# EAGLE design schematic (EAGLE 9.5.0)
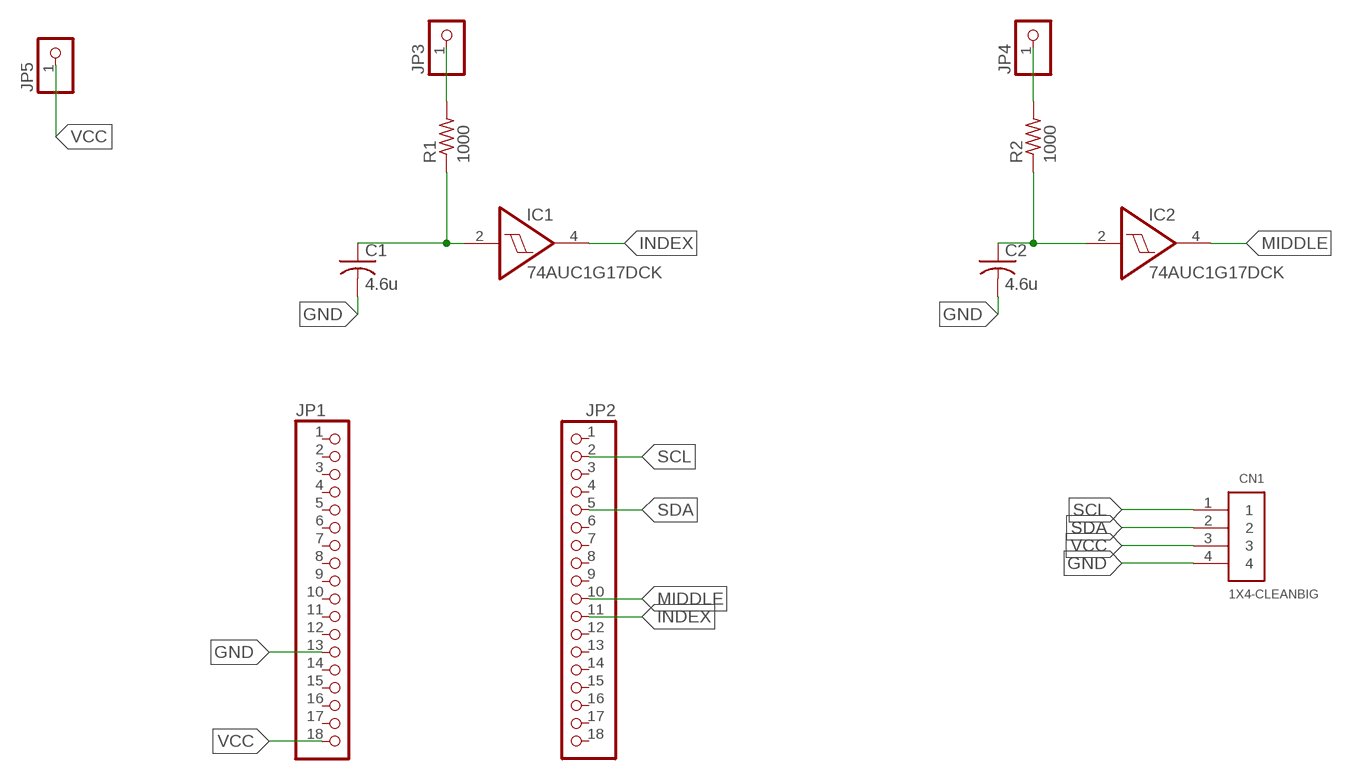
[diagram p0: schematic, sheet 1]

## Parts
C1  4.6u  C-USC0805  [C0805]
C2  4.6u  C-USC0805  [C0805]
CN1  1X4-CLEANBIG  [1X04-CLEANBIG]
IC1  74AUC1G17DCK  [SC70-5]
IC2  74AUC1G17DCK  [SC70-5]
JP1  PINHD-1X18-BIG  [1X18-BIG]
JP2  PINHD-1X18-BIG  [1X18-BIG]
JP3  PINHD-1X1CB  [1X01-CLEANBIG]
JP4  PINHD-1X1CB  [1X01-CLEANBIG]
JP5  PINHD-1X1CB  [1X01-CLEANBIG]
R1  1000  R-US_M0805  [M0805]
R2  1000  R-US_M0805  [M0805]

## Nets
GND: C1.2 C2.2 CN1.4 JP1.13
INDEX: IC1.4(O) JP2.11
MIDDLE: IC2.4(O) JP2.10
N$1: C1.1 IC1.2(I) R1.1
N$2: C2.1 IC2.2(I) R2.1
N$5: JP3.1 R1.2
N$6: JP4.1 R2.2
SCL: CN1.1 JP2.2
SDA: CN1.2 JP2.5
VCC: CN1.3 JP1.18 JP5.1
Unconnected: JP1.1 JP1.2 JP1.3 JP1.4 JP1.5 JP1.6 JP1.7 JP1.8 JP1.9 JP1.10 JP1.11 JP1.12 JP1.14 JP1.15 JP1.16 JP1.17 JP2.1 JP2.3 JP2.4 JP2.6 JP2.7 JP2.8 JP2.9 JP2.12 JP2.13 JP2.14 JP2.15 JP2.16 JP2.17 JP2.18

## Power pins joined to a net without a drawn wire
GND: IC1.3(GND) IC2.3(GND)
VCC: IC1.5(VCC) IC2.5(VCC)

## Library data of the parts
C1 C2 = adafruit:C-US: CAPACITOR, American symbol
CN1 = adafruit:1X4: 4-pin connector
IC1 IC2 = 74xx-little-de:74*1G17: Single Schmitt-Trigger Buffer
JP1 JP2 = adafruit:PINHD-1X18: PIN HEADER
JP3-JP5 = adafruit:PINHD-1X1: Pin header 1x1 for 0.1" spacing With round pins
R1 R2 = adafruit:R-US_: RESISTOR, American symbol

## Board
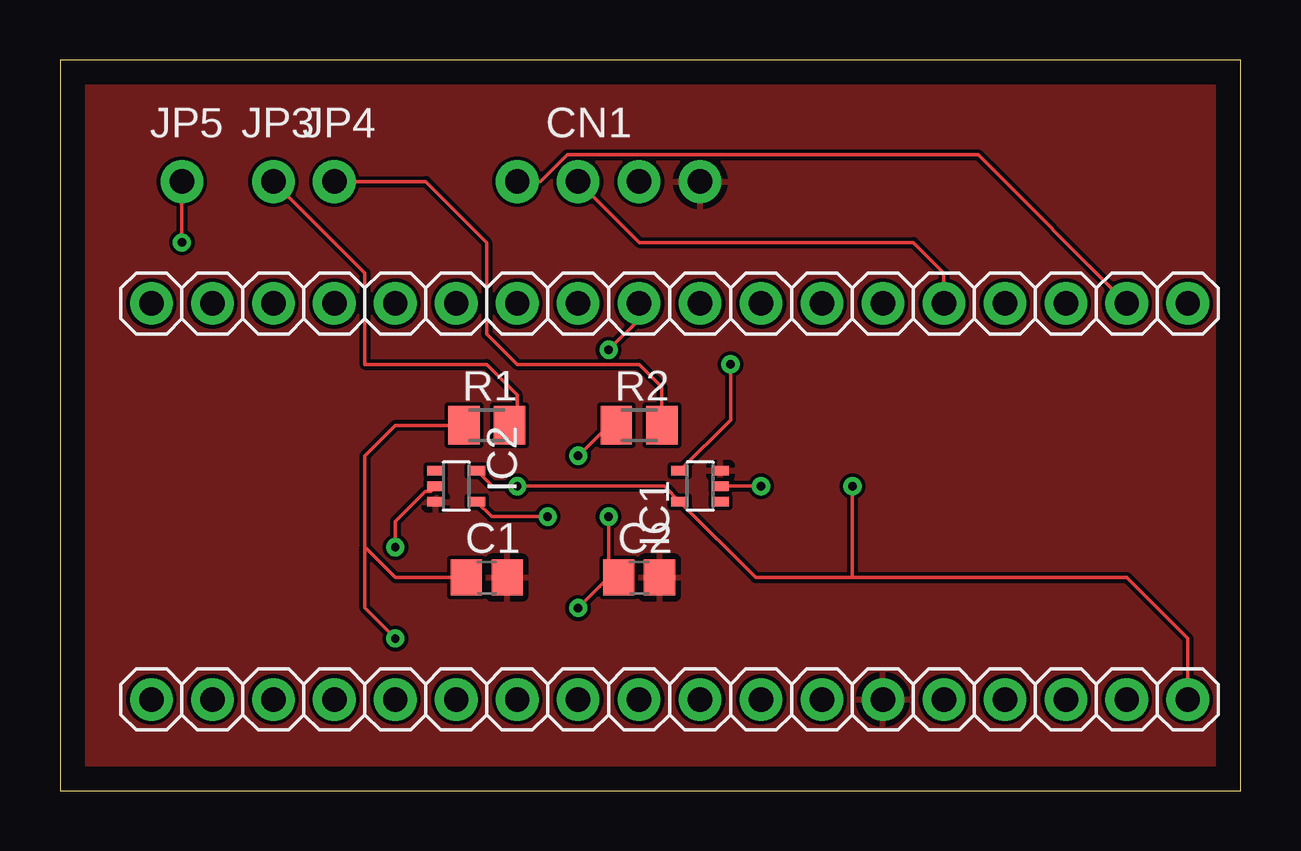
[diagram p1: board, top side]
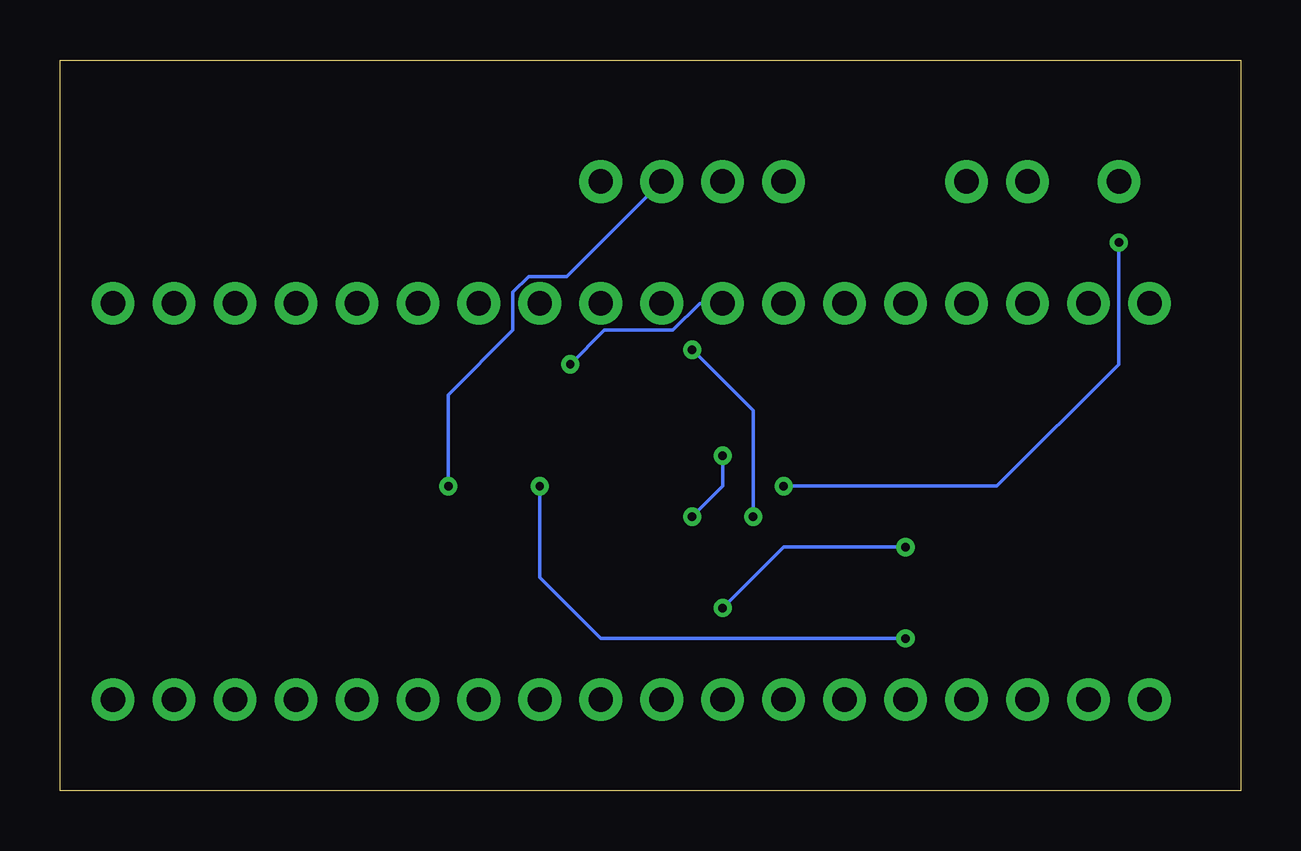
[diagram p2: board, bottom side, seen from below]

Size 49.2 x 30.47 mm. Coordinates in mm from the lower left corner, seen from the top.
Outline: 0,0 49.2,0 49.2,30.47 0,30.47 0,0
Copper layers (1*16): Top 0.035mm / dielectric 1.5mm / Bottom 0.035mm
Design rules "default": minimum track width 6mil, minimum drill 0.35mm, track to track 6mil, track to pad 6mil, pad to pad 6mil, via to via 6mil, smd to smd 6mil, copper to edge 40mil, drill to drill 6mil, minimum pad ring 10mil, minimum via ring 8mil, stop-mask expansion 4mil, vias tented up to drill 0mil, thermal gap 10mil

### Footprints (pad centres in the part's own frame; a part is rotated, then mirrored left to right if it is on the bottom)
C0805 = smd 1.3 x 1.5: 1 -0.85,0; 2 0.85,0
1X04-CLEANBIG = drill 1.016 pad 1.778: 1 -3.81,0; 2 -1.27,0; 3 1.27,0; 4 3.81,0
SC70-5 = smd 0.4 x 0.7: 1 -0.65,-0.85; 2 0,-0.85; 3 0.65,-0.85; 4 0.65,0.85; 5 -0.65,0.85
1X18-BIG = drill 1.016 pad 1.778: 1 -21.59,0; 2 -19.05,0; 3 -16.51,0; 4 -13.97,0; 5 -11.43,0; 6 -8.89,0; 7 -6.35,0; 8 -3.81,0; 9 -1.27,0; 10 1.27,0; 11 3.81,0; 12 6.35,0; 13 8.89,0; 14 11.43,0; 15 13.97,0; 16 16.51,0; 17 19.05,0; 18 21.59,0
1X01-CLEANBIG = drill 1.016 pad 1.778: 1 0,0
M0805 = smd 1.3 x 1.6: 1 -0.95,0; 2 0.95,0

### Placement (x,y rotation side)
C1  17.78,8.89 0 top
C2  24.13,8.89 0 top
CN1  22.86,25.4 0 top
IC1  26.67,12.7 90 top
IC2  16.51,12.7 270 top
JP1  25.4,3.81 0 top
JP2  25.4,20.32 180 top
JP3  8.89,25.4 0 top
JP4  11.43,25.4 0 top
JP5  5.08,25.4 0 top
R1  17.78,15.24 0 top
R2  24.13,15.24 0 top

### Tracks (layer width: path | path; a pad name or v marks a point on that pad's centre or on a via)
GND
  pour Top: -1.27,31.75 -1.27,-1.27 50.8,-1.27 50.8,31.75
INDEX  (via drill 0.35)
  Top 0.152: IC1.4 27.94,15.47 v27.94,17.78
  Bottom 0.152: v27.94,17.78 26.52,19.2 23.67,19.2 22.55,20.32 JP2.11
MIDDLE  (via drill 0.35)
  Top 0.152: IC2.4 17.98,11.43 v20.32,11.43 | v22.86,18.39 24.13,19.66 JP2.10
  Bottom 0.152: v20.32,11.43 20.32,15.85 v22.86,18.39
N$1  (via drill 0.35)
  Top 0.152: R1.1 13.97,15.24 12.7,13.97 12.7,10.16 | 12.7,10.16 13.97,8.89 C1.1 | IC1.2 v29.21,12.7 | v13.97,6.35 12.7,7.62 12.7,10.16
  Bottom 0.152: v29.21,12.7 29.21,8.89 26.67,6.35 v13.97,6.35
N$2  (via drill 0.35)
  Top 0.152: v22.86,11.43 22.86,9.31 C2.1 22.86,8.89 v21.59,7.62 | v21.59,13.97 22.86,15.24 R2.1 | IC2.2 15.44,12.48 15.22,12.48 13.97,11.23 v13.97,10.16
  Bottom 0.152: v22.86,11.43 21.59,12.7 v21.59,13.97 | v13.97,10.16 19.05,10.16 v21.59,7.62
N$5
  Top 0.152: JP3.1 12.7,21.59 12.7,17.78 17.78,17.78 19.05,16.51 19.05,15.56 R1.2
N$6
  Top 0.152: JP4.1 15.24,25.4 17.78,22.86 17.78,19.05 19.05,17.78 24.13,17.78 25.08,16.83 R2.2
SCL
  Top 0.152: CN1.1 20.01,25.4 21.13,26.52 38.25,26.52 JP2.2
SDA
  Top 0.152: CN1.2 24.13,22.86 35.56,22.86 36.83,21.59 JP2.5
VCC  (via drill 0.35)
  Top 0.152: JP5.1 v5.08,22.86 | IC2.5 18.01,12.7 v19.05,12.7 25.17,12.7 IC1.5 28.98,8.89 33.02,8.89 | 33.02,8.89 44.45,8.89 46.99,6.35 JP1.18 | v33.02,12.7 33.02,8.89
  Bottom 0.152: v5.08,22.86 5.08,17.78 10.16,12.7 v19.05,12.7 | v33.02,12.7 33.02,16.51 30.33,19.2 30.33,20.78 29.67,21.44 28.09,21.44 CN1.3